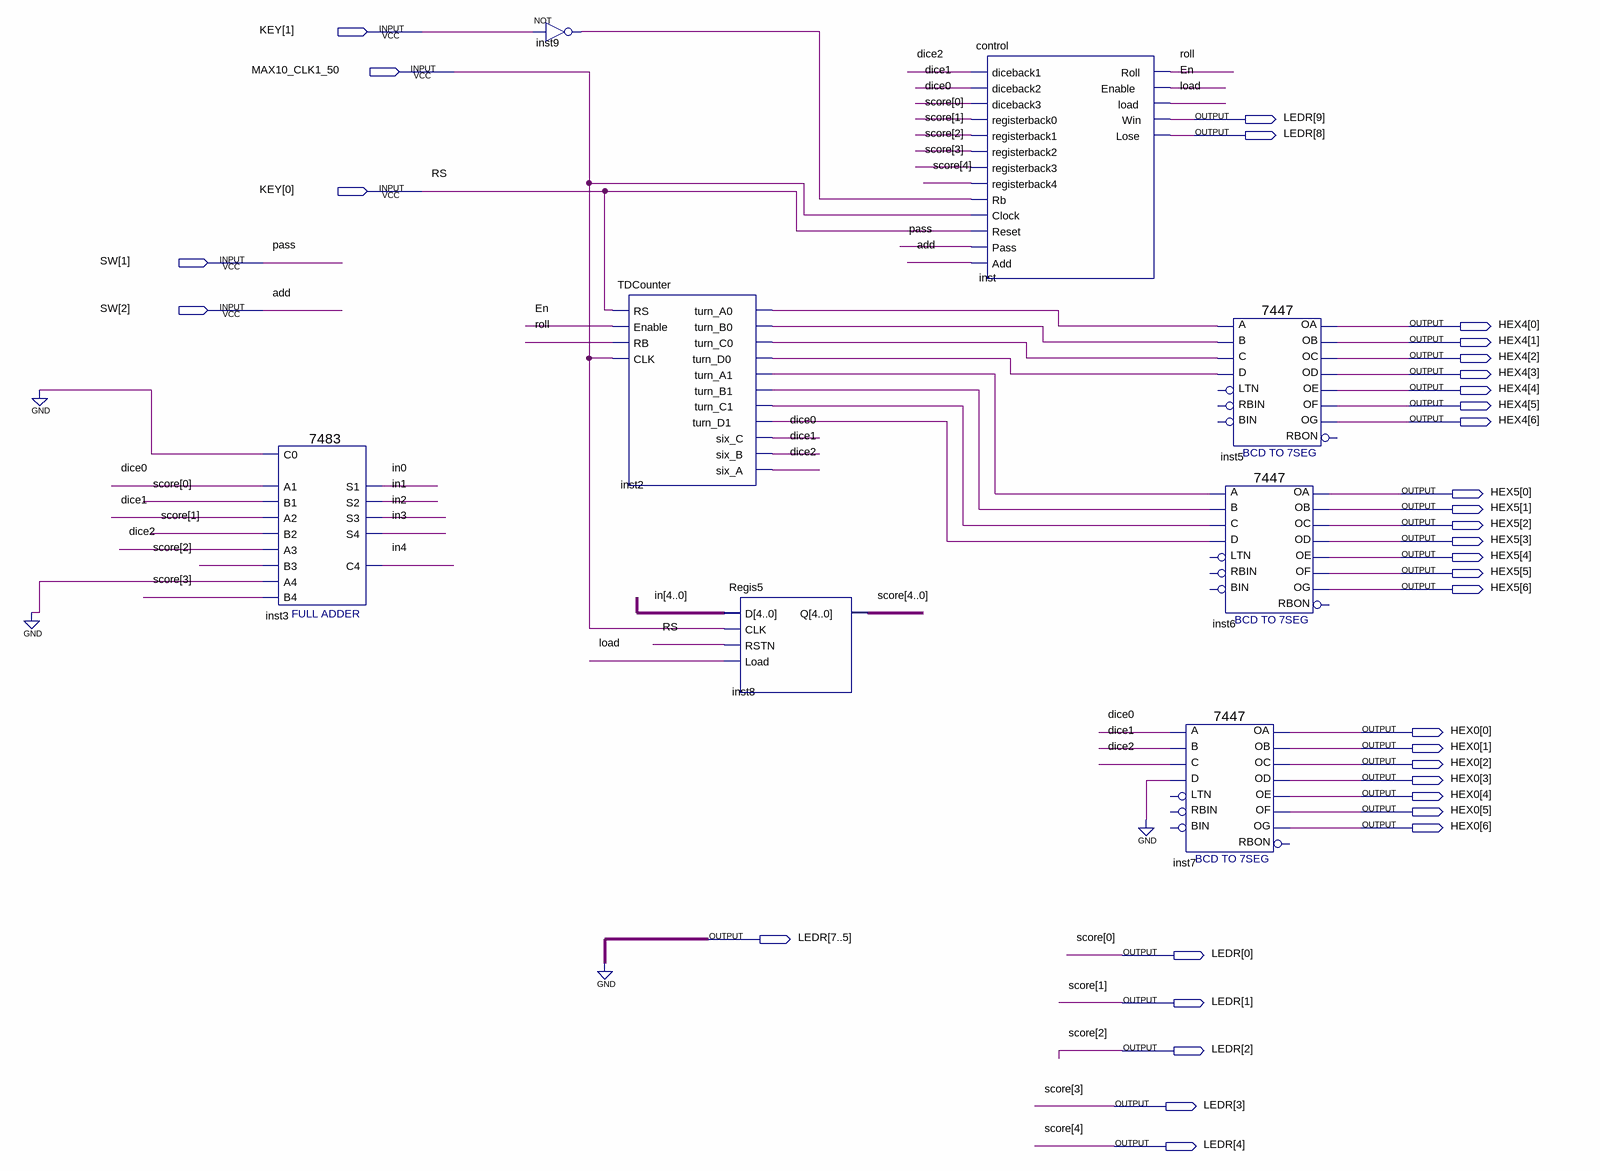
[diagram p0: schematic sheet]
// Quartus schematic lab6final.bdf as structural Verilog: 8 symbols, 34 pins
module lab6final (
  input  [1:0] KEY,
  input  MAX10_CLK1_50,
  input  [2:1] SW,
  output [9:0] LEDR,
  output [6:0] HEX4,
  output [6:0] HEX5,
  output [6:0] HEX0
);

  wire dice0, dice1, dice2, En, inst2_turn_a0, inst2_turn_a1, inst2_turn_b0, inst2_turn_b1, inst2_turn_c0,
       inst2_turn_c1, inst2_turn_d0, inst2_turn_d1, inst9_out, load, roll;
  wire [4:0] in;

  \7483  inst3 (
    .B4(LEDR[3]), .C0(1'b0), .A1(dice0), .A2(dice1), .B1(LEDR[0]), .B2(LEDR[1]), .A3(dice2), .B3(LEDR[2]),
    .A4(1'b0), .S3(in[2]), .S4(in[3]), .S2(in[1]), .C4(in[4]), .S1(in[0]));
  not inst9 (inst9_out, KEY[1]);
  TDCounter inst2 (
    .RS(KEY[0]), .Enable(En), .RB(roll), .CLK(MAX10_CLK1_50), .turn_A0(inst2_turn_a0),
    .turn_B0(inst2_turn_b0), .turn_C0(inst2_turn_c0), .turn_D0(inst2_turn_d0), .turn_A1(inst2_turn_a1),
    .turn_B1(inst2_turn_b1), .turn_C1(inst2_turn_c1), .turn_D1(inst2_turn_d1), .six_C(dice0), .six_B(dice1),
    .six_A(dice2));
  Regis5 inst8 (.D(in), .CLK(MAX10_CLK1_50), .RSTN(KEY[0]), .Load(load), .Q(LEDR[4:0]));
  control inst (
    .diceback1(dice2), .diceback2(dice1), .diceback3(dice0), .registerback0(LEDR[0]),
    .registerback1(LEDR[1]), .registerback2(LEDR[2]), .registerback3(LEDR[3]), .registerback4(LEDR[4]),
    .Rb(inst9_out), .Clock(MAX10_CLK1_50), .Reset(KEY[0]), .Pass(SW[1]), .Add(SW[2]), .Roll(roll),
    .Enable(En), .load(load), .Win(LEDR[9]), .Lose(LEDR[8]));
  \7447  inst5 (
    .B(inst2_turn_b0), .C(inst2_turn_c0), .D(inst2_turn_d0), .A(inst2_turn_a0), .OB(HEX4[1]), .OC(HEX4[2]),
    .OE(HEX4[4]), .OD(HEX4[3]), .OF(HEX4[5]), .OG(HEX4[6]), .OA(HEX4[0]));  // open: LTN, RBIN, BIN, RBON
  \7447  inst6 (
    .B(inst2_turn_b1), .C(inst2_turn_c1), .D(inst2_turn_d1), .A(inst2_turn_a1), .OB(HEX5[1]), .OC(HEX5[2]),
    .OE(HEX5[4]), .OD(HEX5[3]), .OF(HEX5[5]), .OG(HEX5[6]), .OA(HEX5[0]));  // open: LTN, RBIN, BIN, RBON
  \7447  inst7 (
    .B(dice1), .C(dice2), .D(1'b0), .A(dice0), .OB(HEX0[1]), .OC(HEX0[2]), .OE(HEX0[4]), .OD(HEX0[3]),
    .OF(HEX0[5]), .OG(HEX0[6]), .OA(HEX0[0]));  // open: LTN, RBIN, BIN, RBON

  assign LEDR[7:5] = 3'b000;

  // Other names for the same wires on the sheet: add = SW[2]; pass = SW[1]; RS = KEY[0]; score[4:0] = LEDR[4:0]
endmodule
